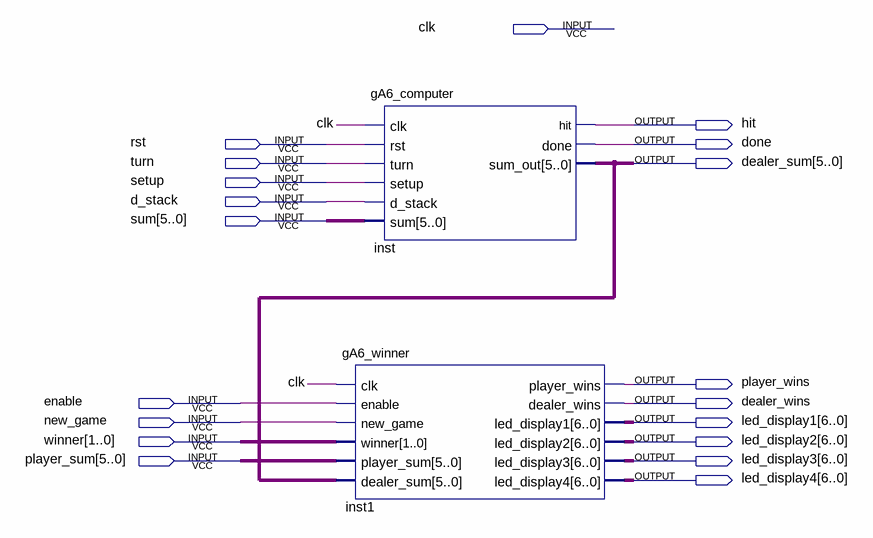
[diagram p0: schematic sheet]
// Quartus schematic gA6_block_computer.bdf as structural Verilog: 2 symbols, 19 pins
module gA6_block_computer (
  input  clk,
  input  rst,
  input  turn,
  input  setup,
  input  d_stack,
  input  [5:0] sum,
  input  enable,
  input  new_game,
  input  [1:0] winner,
  input  [5:0] player_sum,
  output hit,
  output done,
  output [5:0] dealer_sum,
  output player_wins,
  output dealer_wins,
  output [6:0] led_display1,
  output [6:0] led_display2,
  output [6:0] led_display3,
  output [6:0] led_display4
);

  gA6_winner inst1 (
    .clk(clk), .enable(enable), .new_game(new_game), .winner(winner), .player_sum(player_sum),
    .dealer_sum(dealer_sum), .player_wins(player_wins), .dealer_wins(dealer_wins),
    .led_display1(led_display1), .led_display2(led_display2), .led_display3(led_display3),
    .led_display4(led_display4));
  gA6_computer inst (
    .clk(clk), .rst(rst), .turn(turn), .setup(setup), .d_stack(d_stack), .sum(sum), .hit(hit), .done(done),
    .sum_out(dealer_sum));
endmodule
